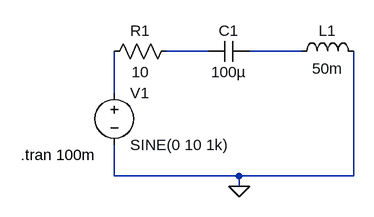
[diagram p0: schematic Draft1.asc]
Draft1.asc, the LTspice schematic file:
Version 4
SHEET 1 880 680
WIRE 224 96 160 96
WIRE 368 96 288 96
WIRE 80 160 80 96
WIRE 80 288 80 240
WIRE 272 288 80 288
WIRE 448 288 448 96
WIRE 448 288 272 288
WIRE 272 304 272 288
FLAG 272 304 0
SYMBOL res 176 80 R90
WINDOW 0 0 56 VBottom 2
WINDOW 3 32 56 VTop 2
SYMATTR InstName R1
SYMATTR Value 10
SYMBOL cap 288 80 R90
WINDOW 0 0 32 VBottom 2
WINDOW 3 32 32 VTop 2
SYMATTR InstName C1
SYMATTR Value 100µ
SYMBOL ind 352 112 R270
WINDOW 0 32 56 VTop 2
WINDOW 3 5 56 VBottom 2
SYMATTR InstName L1
SYMATTR Value 50m
SYMBOL voltage 80 144 R0
WINDOW 123 0 0 Left 0
WINDOW 39 0 0 Left 0
SYMATTR InstName V1
SYMATTR Value SINE(0 10 1k)
TEXT -64 256 Left 2 !.tran 100m

The netlist it stands for:
* Draft1.asc
R1 N001 N003 10
C1 N002 N001 100µ
L1 N002 0 50m
V1 N003 0 SINE(0 10 1k)
.tran 100m
.backanno
.end